# EAGLE board Hauptplatine (EAGLE 7.7.0), part 1 of 2
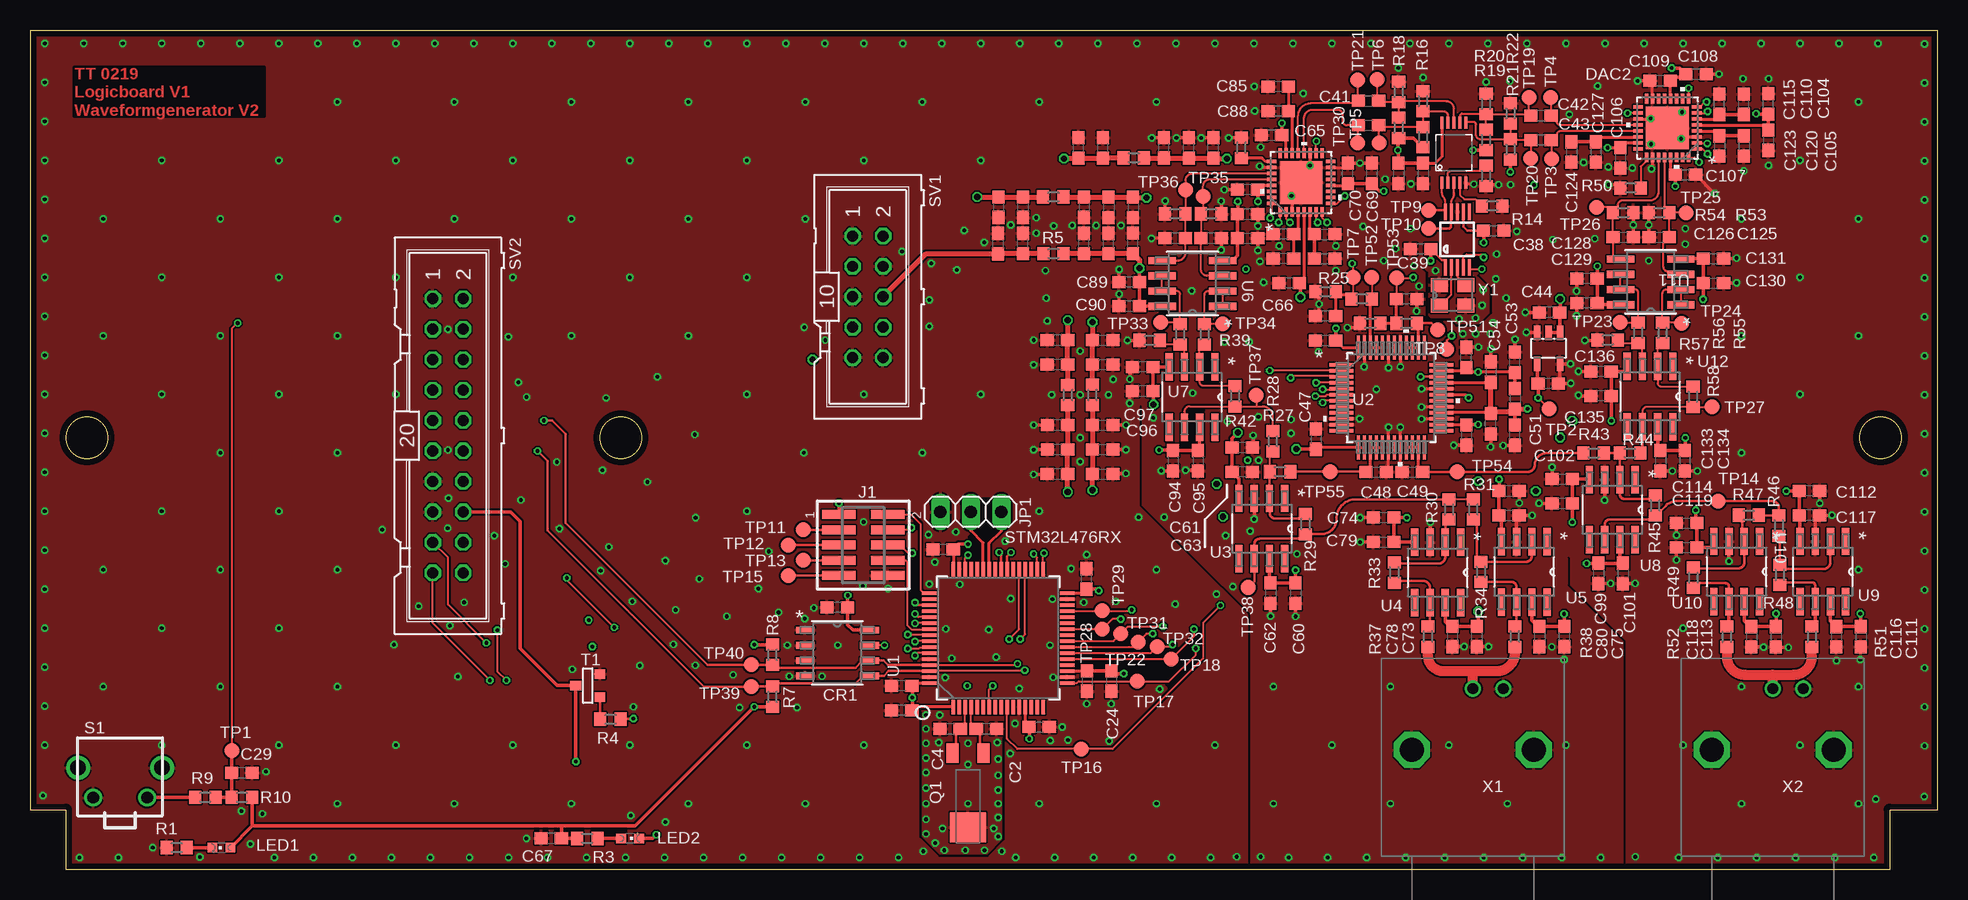
[diagram p6: board, top side]
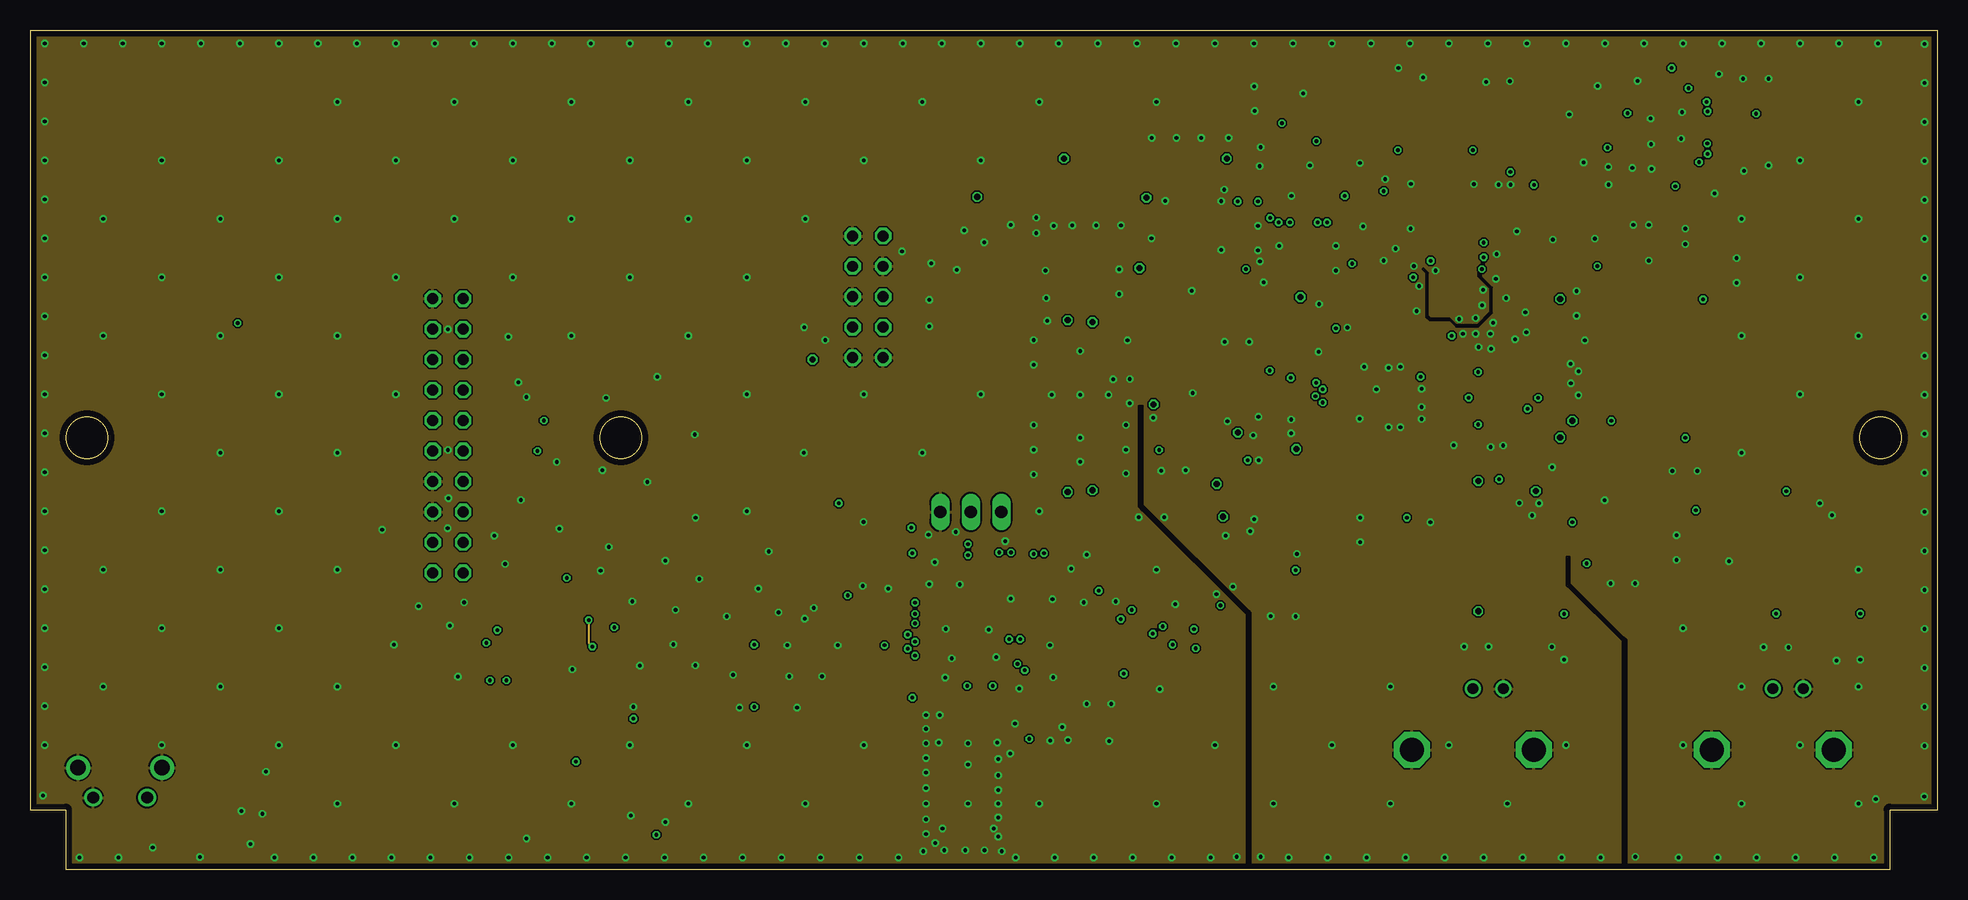
[diagram p7: board, inner layer GND]
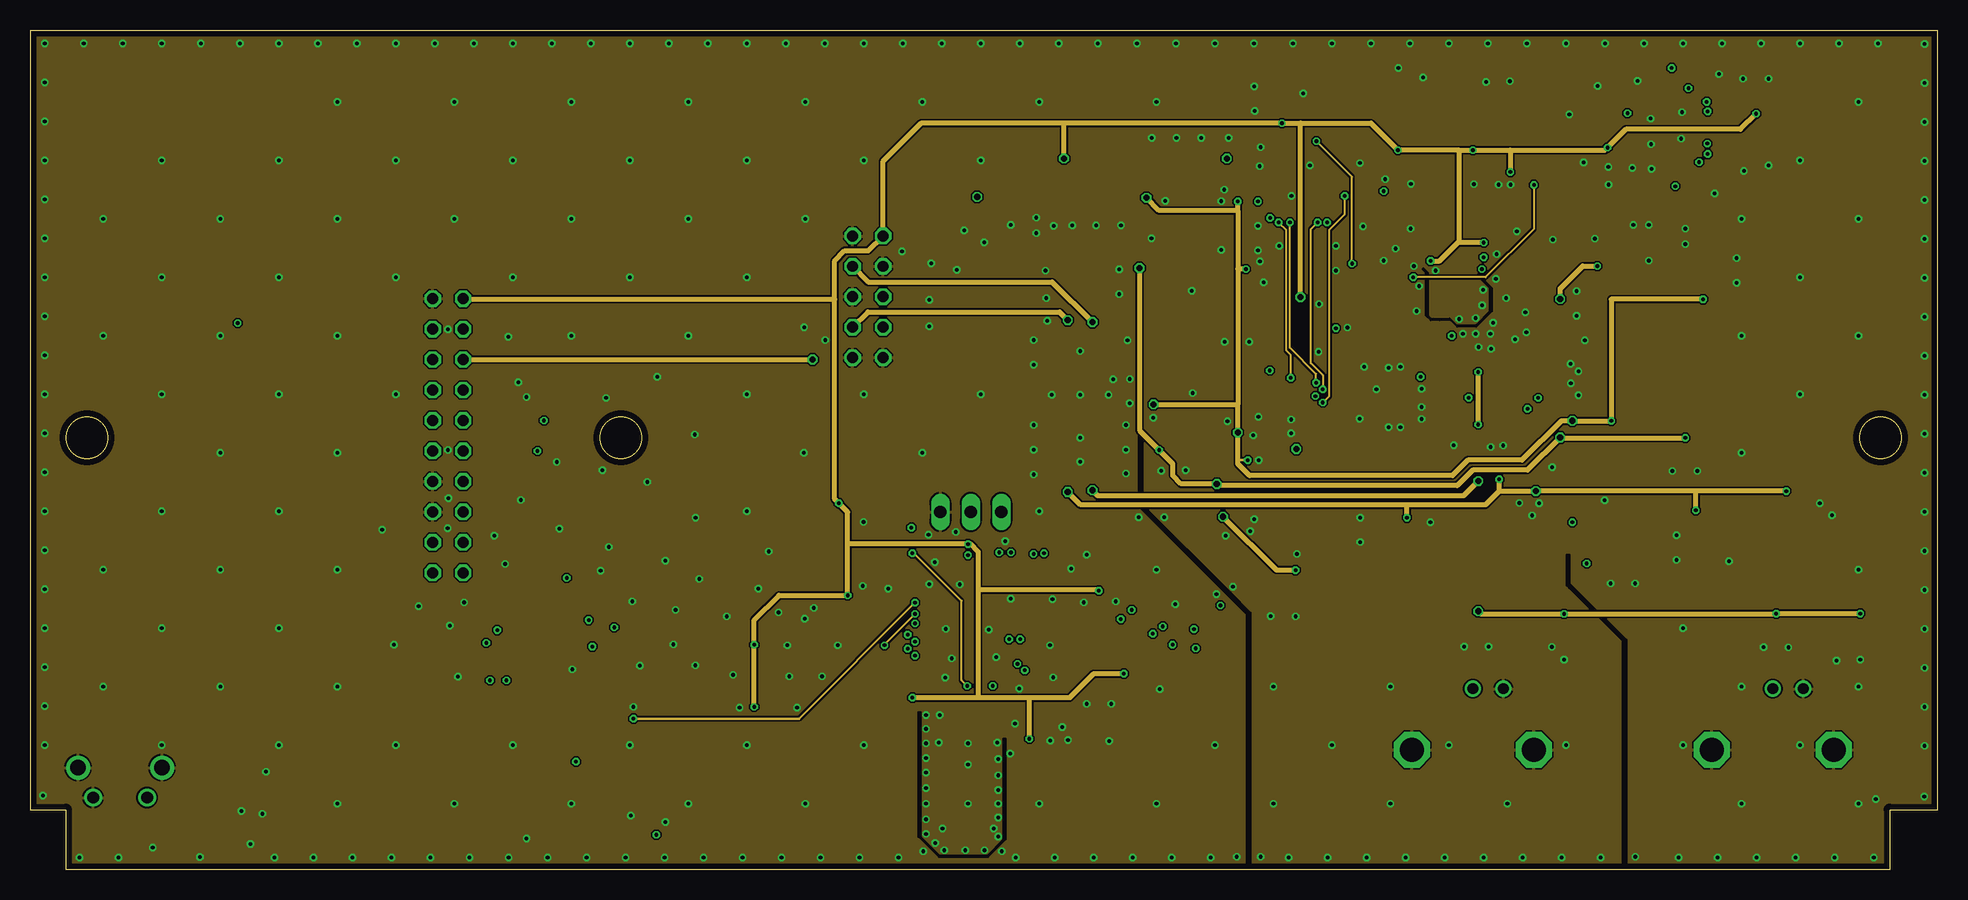
[diagram p8: board, inner layer vcc]
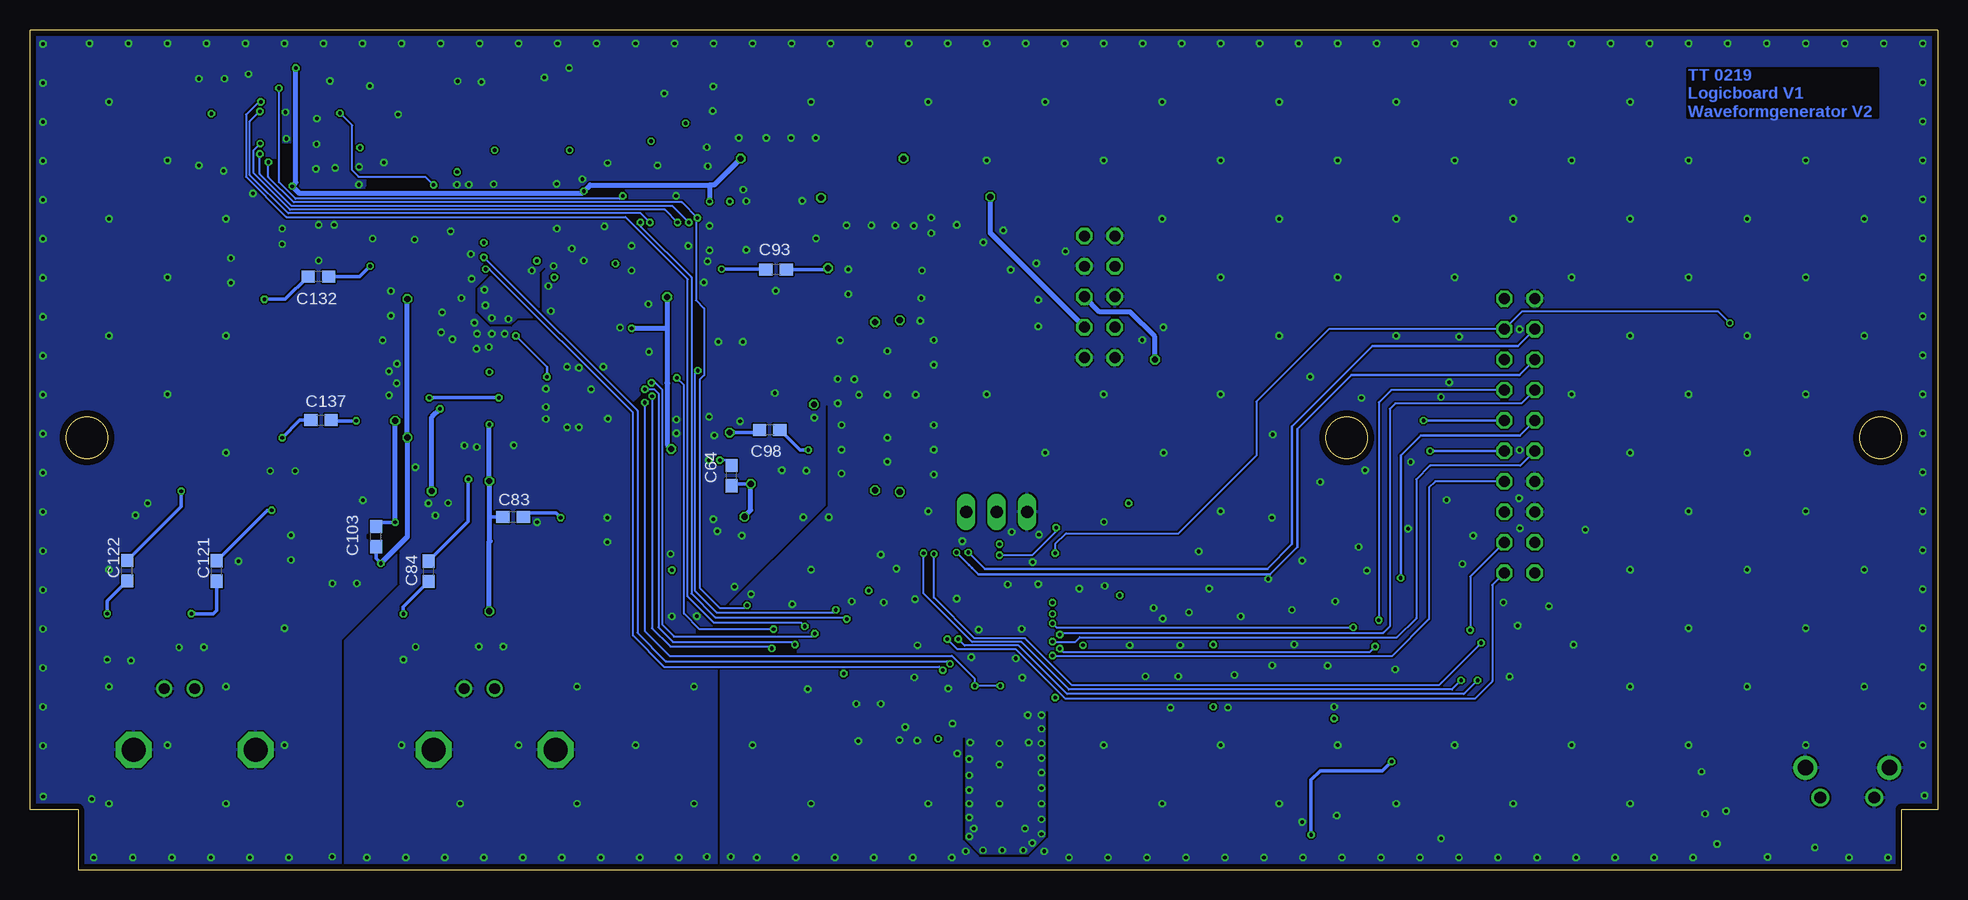
[diagram p9: board, bottom side, seen from below]

Size 159 x 70.01 mm. Coordinates in mm from the lower left corner, seen from the top.
Outline: 0,70.01 159,70.01 159,5 155,5 155,0 3,0 3,5 0,5 0,70.01
Outline: circle at 154.25,36 radius 1.75
Outline: circle at 49.25,36 radius 1.75
Outline: circle at 4.75,36 radius 1.75
Copper layers (1+2+15+16): Top 0.035mm / dielectric 1.5mm / GND 0.035mm / dielectric 0.15mm / vcc 0.035mm / dielectric 0.2mm / Bottom 0.035mm
Design rules "fraese_lpkf *": minimum track width 6mil, minimum drill 12mil, track to track 6mil, track to pad 6mil, pad to pad 6mil, via to via 6mil, smd to smd 6mil, copper to edge 20mil, drill to drill 10mil, minimum pad ring 6mil, minimum via ring 6mil, stop-mask expansion 4mil, vias tented up to drill 0mil, thermal gap 6mil
tRestrict: 28 lines
bRestrict: 31 lines

## Footprints (pad centres in the part's own frame; a part is rotated, then mirrored left to right if it is on the bottom)
C0603 = smd 1.1 x 1: 1 -0.85,0; 2 0.85,0
SO-8 = smd 1.549 x 0.559: 1 -2.68,1.905; 2 -2.68,0.635; 3 -2.68,-0.635; 4 -2.68,-1.905; 5 2.68,-1.905; 6 2.68,-0.635; 7 2.68,0.635; 8 2.68,1.905
CP_32_12 = smd 0.8 x 0.29: 1 -2.451,1.75; 2 -2.451,1.25; 3 -2.451,0.75; 4 -2.451,0.25; 5 -2.451,-0.25; 7 -2.451,-1.25; 8 -2.451,-1.75; 17 2.451,-1.75; 18 2.451,-1.25; 19 2.451,-0.75; 20 2.451,-0.25; 21 2.451,0.25; 22 2.451,0.75; 23 2.451,1.25; 24 2.451,1.75 | smd 0.813 x 0.305: 6 -2.451,-0.75 | smd 0.29 x 0.8: 9 -1.75,-2.451; 10 -1.25,-2.451; 11 -0.75,-2.451; 12 -0.25,-2.451; 13 0.25,-2.451; 14 0.75,-2.451; 15 1.25,-2.451; 16 1.75,-2.451; 25 1.75,2.451; 26 1.25,2.451; 27 0.75,2.451; 28 0.25,2.451; 29 -0.25,2.451; 30 -0.75,2.451; 31 -1.25,2.451; 32 -1.75,2.451 | smd 3.556 x 3.556: 33 0,0
MSOP(K10-1) = smd 1 x 0.25: /D0 -2.5,0.5; /D1 -2.5,-0.5; /Q0 2.5,0; /Q1 2.5,-1; D0 -2.5,1; D1 -2.5,0; GND -2.5,-1; Q0 2.5,0.5; Q1 2.5,-0.5; VCC 2.5,1
MSOP10 = smd 0.25 x 1.4: 1 -1,-2.313; 2 -0.5,-2.313; 3 0,-2.313; 4 0.5,-2.313; 5 1,-2.313; 6 1,2.313; 7 0.5,2.313; 8 0,2.313; 9 -0.5,2.313; 10 -1,2.313
FTSH-105-01-XXX-DV-K = smd 0.737 x 2.794: 1 -2.54,-2.032; 2 -2.54,2.032; 3 -1.27,-2.032; 4 -1.27,2.032; 5 0,-2.032; 6 0,2.032; 7 1.27,-2.032; 8 1.27,2.032; 9 2.54,-2.032; 10 2.54,2.032
1X03 = drill 1.016 long: 1 -2.54,0; 2 0,0; 3 2.54,0
CHIPLED_0603 = smd 0.8 x 0.8: A 0,-0.75; C 0,0.75
MS1V-T1K = smd 1 x 1.6: 1 -1.3,0.8; 2 1.3,0.8 | smd 3 x 2.5: GND 0,7
R0603 = smd 1 x 1.1: 1 -0.85,0; 2 0.85,0
TASTER3305 = drill 0.991 pad 1.499: 3 -2.25,0; 4 2.25,0 | drill 1.3 pad 2: GND -3.5,2.5; GND2 3.5,2.5
ML10 = drill 0.914 octagon: 1 -5.08,-1.27; 2 -5.08,1.27; 3 -2.54,-1.27; 4 -2.54,1.27; 5 0,-1.27; 6 0,1.27; 7 2.54,-1.27; 8 2.54,1.27; 9 5.08,-1.27; 10 5.08,1.27
ML20 = drill 0.914 octagon: 1 -11.43,-1.27; 2 -11.43,1.27; 3 -8.89,-1.27; 4 -8.89,1.27; 5 -6.35,-1.27; 6 -6.35,1.27; 7 -3.81,-1.27; 8 -3.81,1.27; 9 -1.27,-1.27; 10 -1.27,1.27; 11 1.27,-1.27; 12 1.27,1.27; 13 3.81,-1.27; 14 3.81,1.27; 15 6.35,-1.27; 16 6.35,1.27; 17 8.89,-1.27; 18 8.89,1.27; 19 11.43,-1.27; 20 11.43,1.27
SOT-23 = smd 0.787 x 0.889: 1 0.025,-1.016; 2 -0.94,1.016; 3 0.991,1.016
B1,27 = smd 1.27 x 1.27: TP 0,0
LQFP64-10X10MM = smd 1.194 x 0.305: 1 -5.75,3.75; 2 -5.75,3.25; 3 -5.75,2.75; 4 -5.75,2.25; 5 -5.75,1.75; 6 -5.75,1.25; 7 -5.75,0.75; 8 -5.75,0.25; 9 -5.75,-0.25; 10 -5.75,-0.75; 11 -5.75,-1.25; 12 -5.75,-1.75; 13 -5.75,-2.25; 14 -5.75,-2.75; 15 -5.75,-3.25; 16 -5.75,-3.75; 33 5.75,-3.75; 34 5.75,-3.25; 35 5.75,-2.75; 36 5.75,-2.25; 37 5.75,-1.75; 38 5.75,-1.25; 39 5.75,-0.75; 40 5.75,-0.25; 41 5.75,0.25; 42 5.75,0.75; 43 5.75,1.25; 44 5.75,1.75; 45 5.75,2.25; 46 5.75,2.75; 47 5.75,3.25; 48 5.75,3.75 | smd 0.305 x 1.194: 17 -3.75,-5.75; 18 -3.25,-5.75; 19 -2.75,-5.75; 20 -2.25,-5.75; 21 -1.75,-5.75; 22 -1.25,-5.75; 23 -0.75,-5.75; 24 -0.25,-5.75; 25 0.25,-5.75; 26 0.75,-5.75; 27 1.25,-5.75; 28 1.75,-5.75; 29 2.25,-5.75; 30 2.75,-5.75; 31 3.25,-5.75; 32 3.75,-5.75; 49 3.75,5.75; 50 3.25,5.75; 51 2.75,5.75; 52 2.25,5.75; 53 1.75,5.75; 54 1.25,5.75; 55 0.75,5.75; 56 0.25,5.75; 57 -0.25,5.75; 58 -0.75,5.75; 59 -1.25,5.75; 60 -1.75,5.75; 61 -2.25,5.75; 62 -2.75,5.75; 63 -3.25,5.75; 64 -3.75,5.75
PFB48-M = smd 1.981 x 0.279: 1 -4.166,2.75; 2 -4.166,2.25; 3 -4.166,1.75; 4 -4.166,1.25; 5 -4.166,0.75; 6 -4.166,0.25; 7 -4.166,-0.25; 8 -4.166,-0.75; 9 -4.166,-1.25; 10 -4.166,-1.75; 11 -4.166,-2.25; 12 -4.166,-2.75; 25 4.166,-2.75; 26 4.166,-2.25; 27 4.166,-1.75; 28 4.166,-1.25; 29 4.166,-0.75; 30 4.166,-0.25; 31 4.166,0.25; 32 4.166,0.75; 33 4.166,1.25; 34 4.166,1.75; 35 4.166,2.25; 36 4.166,2.75 | smd 0.279 x 1.981: 13 -2.75,-4.166; 14 -2.25,-4.166; 15 -1.75,-4.166; 16 -1.25,-4.166; 17 -0.75,-4.166; 18 -0.25,-4.166; 19 0.25,-4.166; 20 0.75,-4.166; 21 1.25,-4.166; 22 1.75,-4.166; 23 2.25,-4.166; 24 2.75,-4.166; 37 2.75,4.166; 38 2.25,4.166; 39 1.75,4.166; 40 1.25,4.166; 41 0.75,4.166; 42 0.25,4.166; 43 -0.25,4.166; 44 -0.75,4.166; 45 -1.25,4.166; 46 -1.75,4.166; 47 -2.25,4.166; 48 -2.75,4.166
D8-M = smd 2.286 x 0.61: 1 -2.515,1.905; 2 -2.515,0.635; 3 -2.515,-0.635; 4 -2.515,-1.905; 5 2.515,-1.905; 6 2.515,-0.635; 7 2.515,0.635; 8 2.515,1.905
M08A-M = smd 2.286 x 0.61: 1 -2.515,1.905; 2 -2.515,0.635; 3 -2.515,-0.635; 4 -2.515,-1.905; 5 2.515,-1.905; 6 2.515,-0.635; 7 2.515,0.635; 8 2.515,1.905
SOT23-5L = smd 0.55 x 1.2: 1 -0.95,-1.3; 2 0,-1.3; 3 0.95,-1.3; 4 0.95,1.3; 5 -0.95,1.3
740845_BNC = drill 2 octagon: CASE1 -5.08,5.08; CASE2 5.08,5.08 | drill 0.9: SHIELD -2.54,0; SIGNAL 0,0
CRYSTAL_ABM8G = smd 1.194 x 1.397: 1 -0.851,1.105; 2 -0.851,-1.105; 3 0.851,-1.105; 4 0.851,1.105

## Placement (x,y rotation side)
C1  100nF  [C0603]  87.41,60.17 90 top
C2  6,8pF  [C0603]  79.72,11.71 180 top
C3  10uF  [C0603]  89.44,60.17 90 top
C4  6,8pF  [C0603]  76.69,11.71 180 top
C5  100nF  [C0603]  98.63,60.17 90 top
C6  10uF  [C0603]  94.53,60.18 90 top
C7  100nF  [C0603]  96.59,60.17 90 top
C8  100nF  [C0603]  76.11,26.7 180 top
C9  100nF  [C0603]  88.07,24.24 90 top
C10  100nF  [C0603]  80.71,52.19 90 top
C11  100nF  [C0603]  80.72,55.23 270 top
C12  10uF  [C0603]  82.76,52.2 90 top
C13  10uF  [C0603]  82.75,55.23 270 top
C14  100nF  [C0603]  72.66,13.29 180 top
C15  10uF  [C0603]  89.9,52.2 90 top
C16  10uF  [C0603]  91.95,55.22 270 top
C17  100nF  [C0603]  72.66,15.32 180 top
C18  100nF  [C0603]  91.94,52.21 90 top
C19  100nF  [C0603]  89.91,55.22 270 top
C20  100nF  [C0603]  88.1,15.73 270 top
C21  100nF  [C0603]  87.85,52.2 90 top
C22  100nF  [C0603]  87.84,55.23 270 top
C23  100nF  [C0603]  84.11,11.89 0 top
C24  10uF  [C0603]  90.13,15.73 270 top
C25  100nF  [C0603]  89.42,44.14 0 top
C26  100nF  [C0603]  85.64,42.1 180 top
C27  10uF  [C0603]  89.42,42.1 0 top
C28  10uF  [C0603]  85.64,44.15 180 top
C29  100nF  [C0603]  17.66,8.08 0 top
C30  10uF  [C0603]  89.41,35.01 0 top
C31  10uF  [C0603]  85.64,32.97 180 top
C32  100nF  [C0603]  89.42,37.05 0 top
C33  100nF  [C0603]  85.65,37.05 180 top
C34  100nF  [C0603]  89.41,32.98 0 top
C35  100nF  [C0603]  85.65,35.02 180 top
C36  100nF  [C0603]  116.12,58.04 270 top
C37  100nF  [C0603]  114.08,58.04 270 top
C38  100nF  [C0603]  122.01,53.27 0 top
C39  100nF  [C0603]  115.91,51.75 180 top
C40  100nF  [C0603]  111.57,62.06 0 top
C41  100nF  [C0603]  111.57,64.09 0 top
C42  100nF  [C0603]  125.94,62.85 180 top
C43  100nF  [C0603]  125.94,60.81 180 top
C44  10uF  [C0603]  126.66,46.46 180 top
C45  10uF  [C0603]  126.55,40.54 180 top
C46  10uF  [C0603]  107.99,44.13 0 top
C47  100nF  [C0603]  107.17,35.9 270 top
C48  nb_100nF  [C0603]  112.2,33.15 0 top
C49  nb_100nF  [C0603]  115.23,33.15 0 top
C50  10uF  [C0603]  119.72,42.7 90 top
C51  10uF  [C0603]  123.79,36.23 90 top
C52  10uF  [C0603]  67.3,21.88 180 top
C53  100nF  [C0603]  123.79,42.3 90 top
C54  100nF  [C0603]  121.75,41.48 270 top
C55  100nF  [C0603]  119.72,36.23 270 top
C56  100nF  [C0603]  121.75,37.17 90 top
C57  100nF  [C0603]  123.79,39.25 270 top
C58  100nF  [C0603]  107.99,46.16 180 top
C59  100nF  [C0603]  114.74,47.58 180 top
C60  10uF  [C0603]  105.5,23.04 270 top
C61  10uF  [C0603]  101.05,35.18 180 top
C62  100nF  [C0603]  103.42,23.04 270 top
C63  100nF  [C0603]  101.05,33.15 180 top
C64  100nF  [C0603]  100.52,32.85 90 bottom
C65  100nF  [C0603]  103.49,61.22 180 top
C66  100nF  [C0603]  104.96,48.9 180 top
C67  10uF  [C0603]  43.45,2.6 180 top
C68  100nF  [C0603]  101.48,56.7 180 top
C69  100nF  [C0603]  111.87,58.04 90 top
C70  10uF  [C0603]  109.84,58.04 90 top
C71  100nF  [C0603]  107.91,50.93 0 top
C72  100pF  [C0603]  107.91,52.96 0 top
C73  10uF  [C0603]  120.59,19.44 270 top
C74  10uF  [C0603]  112.84,29.34 0 top
C75  10uF  [C0603]  127.88,19.44 270 top
C76  10uF  [C0603]  123.28,31.55 180 top
C77  100nF  [C0603]  104.48,50.96 180 top
C78  100nF  [C0603]  118.55,19.44 270 top
C79  100nF  [C0603]  112.84,27.31 0 top
C80  100nF  [C0603]  125.82,19.44 270 top
C81  100nF  [C0603]  123.28,29.52 180 top
C82  100pF  [C0603]  104.48,52.99 180 top
C83  100nF  [C0603]  118.73,29.42 0 bottom
C84  100nF  [C0603]  125.77,24.87 90 bottom
C85  100nF  [C0603]  104.05,65.28 180 top
C86  8,2pF  [C0603]  98.46,52.63 180 top
C87  8,2pF  [C0603]  95.46,52.63 180 top
C88  100pF  [C0603]  104.05,63.25 180 top
C89  10uF  [C0603]  91.63,49 180 top
C90  100nF  [C0603]  91.63,46.97 180 top
C91  10uF  [C0603]  101.48,54.67 0 top
C92  100nF  [C0603]  101.48,52.63 0 top
C93  100nF  [C0603]  96.81,50.04 180 bottom
C94  10uF  [C0603]  95.26,34.09 270 top
C95  100nF  [C0603]  97.34,34.09 270 top
C96  10uF  [C0603]  92.75,39.88 180 top
C97  100nF  [C0603]  92.75,41.92 180 top
C98  100nF  [C0603]  97.34,36.66 180 bottom
C99  10uF  [C0603]  130.75,24.69 270 top
C100  10uF  [C0603]  127.72,30.54 0 top
C101  100nF  [C0603]  132.78,24.69 270 top
C102  100nF  [C0603]  127.72,32.57 0 top
C103  100nF  [C0603]  130.16,27.77 90 bottom
C104  100nF  [C0603]  144.89,63.84 90 top
C105  100nF  [C0603]  144.89,60.81 270 top
C106  10uF  [C0603]  132.55,59.34 270 top
C107  100nF  [C0603]  137.98,57.94 0 top
C108  100nF  [C0603]  138.87,66.33 0 top
C109  10uF  [C0603]  135.88,65.77 180 top
C110  100nF  [C0603]  142.86,63.81 90 top
C111  10uF  [C0603]  152.61,19.41 270 top
C112  10uF  [C0603]  148.32,31.58 180 top
C113  10uF  [C0603]  145.53,19.41 270 top
C114  10uF  [C0603]  138.09,28.89 0 top
C115  100pF  [C0603]  140.83,63.81 90 top
C116  100nF  [C0603]  150.56,19.41 270 top
C117  100nF  [C0603]  148.32,29.55 180 top
C118  100nF  [C0603]  143.5,19.41 270 top
C119  100nF  [C0603]  138.09,26.85 0 top
C120  100nF  [C0603]  142.86,60.33 270 top
C121  100nF  [C0603]  143.42,24.9 90 bottom
C122  100nF  [C0603]  150.91,24.92 90 bottom
C123  100pF  [C0603]  140.83,60.33 270 top
C124  100nF  [C0603]  128.48,59.82 270 top
C125  8,2pF  [C0603]  135.8,52.74 0 top
C126  8,2pF  [C0603]  132.8,52.74 0 top
C127  100pF  [C0603]  130.52,59.82 270 top
C128  10uF  [C0603]  129.78,49.28 180 top
C129  100nF  [C0603]  129.78,47.25 180 top
C130  10uF  [C0603]  140.32,48.9 0 top
C131  100nF  [C0603]  140.32,50.93 0 top
C132  100nF  [C0603]  134.96,49.46 180 bottom
C133  10uF  [C0603]  135.9,34.09 270 top
C134  100nF  [C0603]  137.93,34.09 270 top
C135  10uF  [C0603]  130.95,39.5 180 top
C136  100nF  [C0603]  130.95,41.53 180 top
C137  100nF  [C0603]  134.73,37.47 0 bottom
CR1  M24C64-WMN6P  [SO-8]  67.3,18.07 0 top
DAC1  AD9102  [CP_32_12]  105.96,57.28 90 top
DAC2  AD9102  [CP_32_12]  136.49,61.83 180 top
IC1  SY55857L  [MSOP(K10-1)]  118.71,59.77 90 top
IC2  SI5351A-B-GT  [MSOP10]  118.96,52.53 0 top
J1  FTSH-105-01-XXX-DV-K  [FTSH-105-01-XXX-DV-K]  69.46,27.06 270 top
JP1  [1X03]  78.42,29.83 180 top
LED1  [CHIPLED_0603]  15.96,1.83 90 top
LED2  [CHIPLED_0603]  50.02,2.6 270 top
Q1  MS1V-T1K  [MS1V-T1K]  78.19,10.52 180 top
R1  180R  [R0603]  12.23,1.83 180 top
R2  Ferrit  [R0603]  92.01,59.35 180 top
R3  390R  [R0603]  46.44,2.6 0 top
R4  2k2  [R0603]  48.39,12.54 180 top
R5  Ferrit  [R0603]  85.31,51.36 180 top
R6  Ferrit  [R0603]  85.3,56.08 180 top
R7  4k7  [R0603]  61.89,14.41 270 top
R8  4k7  [R0603]  61.89,17.91 90 top
R9  10k  [R0603]  14.62,6.03 0 top
R10  10k  [R0603]  17.66,6.03 180 top
R11  Ferrit  [R0603]  88.56,39.58 90 top
R12  Ferrit  [R0603]  86.51,39.57 90 top
R13  2k7  [R0603]  121.37,57.84 90 top
R14  2k7  [R0603]  121.88,55.33 180 top
R15  120R  [R0603]  116.12,61.07 270 top
R16  82R  [R0603]  116.12,64.06 270 top
R17  120R  [R0603]  114.08,61.85 270 top
R18  82R  [R0603]  114.08,64.85 270 top
R19  120R  [R0603]  121.37,60.84 270 top
R20  82R  [R0603]  121.37,63.84 270 top
R21  120R  [R0603]  123.4,60.05 270 top
R22  82R  [R0603]  123.4,63.05 270 top
R23  1k5 0,1%  [R0603]  111.01,47.58 180 top
R24  1k5 0,1%  [R0603]  114.74,45.55 180 top
R25  499R 0,1%  [R0603]  107.99,48.19 0 top
R26  499R 0,1%  [R0603]  111.72,45.55 180 top
R27  1k 0,1%  [R0603]  104.2,33.18 0 top
R28  1k 0,1%  [R0603]  103.59,35.72 90 top
R29  1k 0,1%  [R0603]  106.31,28.81 90 top
R30  300R 0,1%  [R0603]  118.27,30.03 270 top
R31  300R 0,1%  [R0603]  120.31,30.03 270 top
R32  10k 0,1%  [R0603]  100.98,60.18 90 top
R33  1k5 0,1%  [R0603]  113.73,24.77 270 top
R34  1k5 0,1%  [R0603]  120.94,24.82 270 top
R35  249R 0,1%  [R0603]  98.46,54.67 0 top
R36  249R 0,1%  [R0603]  95.46,54.67 0 top
R37  100R  [R0603]  116.52,19.44 270 top
R38  100R  [R0603]  123.76,19.44 270 top
R39  249R 0,1%  [R0603]  97.9,44.63 90 top
R40  249R 0,1%  [R0603]  95.87,44.63 90 top
R41  499R 0,1%  [R0603]  93.33,44.13 0 top
R42  499R 0,1%  [R0603]  100.44,39.48 90 top
R43  1k 0,1%  [R0603]  130.34,34.73 180 top
R44  1k 0,1%  [R0603]  133.36,34.73 0 top
R45  1k 0,1%  [R0603]  135.47,30.36 90 top
R46  300R 0,1%  [R0603]  145.78,28.68 270 top
R47  300R 0,1%  [R0603]  143.27,29.55 180 top
R48  1k5 0,1%  [R0603]  145.86,24.57 270 top
R49  1k5 0,1%  [R0603]  138.64,24.34 270 top
R50  10k 0,1%  [R0603]  133.41,56.83 180 top
R51  100R  [R0603]  148.53,19.41 270 top
R52  100R  [R0603]  141.44,19.41 270 top
R53  249R 0,1%  [R0603]  135.8,54.77 180 top
R54  249R 0,1%  [R0603]  132.8,54.77 180 top
R55  249R 0,1%  [R0603]  136.08,44.76 90 top
R56  249R 0,1%  [R0603]  134.05,44.76 90 top
R57  499R 0,1%  [R0603]  131.51,44.15 0 top
R58  499R 0,1%  [R0603]  138.62,39.43 90 top
S1  TASTER3305  [TASTER3305]  7.51,6.01 0 top
SV1  [ML10]  69.84,47.76 270 top
SV2  [ML20]  34.84,36.18 270 top
T1  BSN20  [SOT-23]  46.49,15.37 270 top
TP1  TPB1,27  [B1,27]  16.83,9.94 0 top
TP2  TPB1,27  [B1,27]  126.63,38.44 270 top
TP3  TPB1,27  [B1,27]  126.83,59.26 0 top
TP4  TPB1,27  [B1,27]  126.76,64.39 0 top
TP5  TPB1,27  [B1,27]  112.46,60.58 90 top
TP6  TPB1,27  [B1,27]  112.28,65.87 90 top
TP7  TPB1,27  [B1,27]  110.27,49.38 0 top
TP8  TPB1,27  [B1,27]  117.33,45.01 180 top
TP9  TPB1,27  [B1,27]  116.6,54.97 0 top
TP10  TPB1,27  [B1,27]  116.57,53.45 0 top
TP11  TPB1,27  [B1,27]  64.48,28.33 0 top
TP12  TPB1,27  [B1,27]  63.21,27.06 0 top
TP13  TPB1,27  [B1,27]  64.48,25.79 0 top
TP14  TPB1,27  [B1,27]  140.7,30.71 180 top
TP15  TPB1,27  [B1,27]  63.21,24.52 0 top
TP16  TPB1,27  [B1,27]  87.64,10.06 180 top
TP17  TPB1,27  [B1,27]  92.29,15.7 180 top
TP18  TPB1,27  [B1,27]  95.11,17.53 180 top
TP19  TPB1,27  [B1,27]  124.95,64.37 0 top
TP20  TPB1,27  [B1,27]  125.08,59.31 0 top
TP21  TPB1,27  [B1,27]  110.65,65.84 90 top
TP22  TPB1,27  [B1,27]  92.37,18.98 180 top
TP23  TPB1,27  [B1,27]  132.52,45.62 270 top
TP24  TPB1,27  [B1,27]  137.65,45.55 270 top
TP25  TPB1,27  [B1,27]  138.06,54.77 270 top
TP26  TPB1,27  [B1,27]  130.57,55.23 270 top
TP27  TPB1,27  [B1,27]  140.22,38.59 90 top
TP28  TPB1,27  [B1,27]  89.39,20.05 180 top
TP29  TPB1,27  [B1,27]  89.39,21.57 180 top
TP30  TPB1,27  [B1,27]  110.68,60.58 90 top
TP31  TPB1,27  [B1,27]  90.92,19.67 180 top
TP32  TPB1,27  [B1,27]  93.97,18.6 180 top
TP33  TPB1,27  [B1,27]  94.25,45.62 180 top
TP34  TPB1,27  [B1,27]  99.43,45.5 180 top
TP35  TPB1,27  [B1,27]  97.78,56.11 180 top
TP36  TPB1,27  [B1,27]  96.33,56.67 180 top
TP37  TPB1,27  [B1,27]  102.22,39.55 270 top
TP38  TPB1,27  [B1,27]  101.54,23.53 90 top
TP39  TPB1,27  [B1,27]  60.13,15.25 180 top
TP40  TPB1,27  [B1,27]  60.13,17.07 180 top
TP51  TPB1,27  [B1,27]  118.1,43.39 0 top
TP52  TPB1,27  [B1,27]  111.85,49.38 0 top
TP53  TPB1,27  [B1,27]  113.91,49.33 0 top
TP54  TPB1,27  [B1,27]  118.96,33.15 0 top
TP55  TPB1,27  [B1,27]  108.37,33.18 0 top
U1  STM32L476RX  [LQFP64-10X10MM]  80.71,19.31 90 top
U2  DAC8734SPFBPFB48-M  [PFB48-M]  113.47,39.35 0 top
U3  THS4271  [D8-M]  102.68,28.43 270 top
U4  THS3091  [D8-M]  117.33,24.77 270 top
U5  THS3091  [D8-M]  124.55,24.82 270 top
U6  LMH6612  [M08A-M]  96.89,48.88 180 top
U7  THS4271  [D8-M]  96.86,39.4 270 top
U8  THS4271  [D8-M]  131.89,30 270 top
U9  THS3091  [D8-M]  149.44,24.85 270 top
U10  THS3091  [D8-M]  142.25,24.85 270 top
U11  LMH6612  [M08A-M]  135.09,49 180 top
U12  THS4271  [D8-M]  135.04,39.45 270 top
VREF1  REF2125  [SOT23-5L]  126.58,43.47 180 top
X1  740845_BNC  [740845_BNC]  120.26,15.09 180 top
X2  740845_BNC  [740845_BNC]  145.26,15.09 180 top
Y1  ABM8G-25.000MHZ-B4Y-T  [CRYSTAL_ABM8G]  118.58,47.88 90 top